# Altium project esp-programmer.PrjPcb
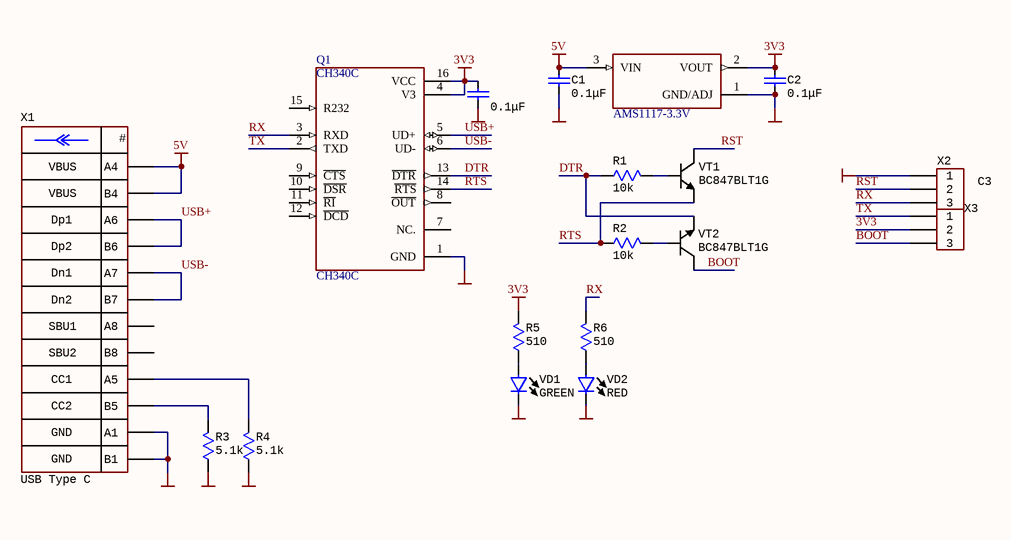
[diagram p0: esp-programmer.SchDoc]
1 sheet, 18 parts. Net scope: global (net labels, ports and power ports of the same name join across sheets).
Board file: esp-programmer.PcbDoc

## Sheet esp-programmer.SchDoc
size A; SheetNumber: 1; SheetTotal: 1

### Parts
C1  value 0.1μF  [CAP: 0603]  (hidden comment: CL10B104KA8NNNL)
C2  value 0.1μF  [CAP: 0603]  (hidden comment: CL10B104KA8NNNL)
C3  value 0.1μF  [CAP: 0603]  (hidden comment: CL10B104KA8NNNL)
Q1  CH340C  [CH240C]
R1  value 10k  [RES: 0603]  (hidden comment: RC0603FR-0710KL)
R2  value 10k  [RES: 0603]  (hidden comment: RC0603FR-0710KL)
R3  value 5.1k  [RES: 0603]  (hidden comment: RC0603FR-075K1L)
R4  value 5.1k  [RES: 0603]  (hidden comment: RC0603FR-075K1L)
R5  value 510  [RES: 0603]  (hidden comment: RC0603FR-07510RL)
R6  value 510  [RES: 0603]  (hidden comment: RC0603FR-07510RL)
VD1  Color: GREEN  [LED: 0603G]  (hidden comment: HSMG-C190)
VD2  Color: RED  [LED: 0603R]  (hidden comment: 155060SS75300)
VT1  BC847BLT1G  [SOT23]
VT2  BC847BLT1G  [SOT23]
X1  USB Type C  [CON: TYPE-C-31-M-12 (USB)]
X2  PMbus  [CON: PLS-3]  (value not drawn)
X3  PMbus  [CON: PLS-3]  (value not drawn)
  AMS1117-3.3V  [SOT223]

### Nets
3V3: C2.1 C3.1 Q1.4(V3) Q1.16(VCC) R5.2 X3.2 .2(VOUT)
5V: C1.1 X1.A4 X1.B4 .3(VIN)
GND: C1.2 C2.2 C3.2 Q1.1(GND) R3.1 R4.1 VD1.2 VD2.2 X1.A1 X1.B1 X2.1 .1(GND/ADJ)
BOOT: VT2.3(C) X3.3
DTR: Q1.13(~{DTR}) R1.1 VT2.2(E)
RST: VT1.3(C) X2.2
RTS: Q1.14(~{RTS}) R2.1 VT1.2(E)
RX: Q1.3(RXD) R6.2 X2.3
TX: Q1.2(TXD) X3.1
USB+: Q1.5(UD+) X1.A6 X1.B6
USB-: Q1.6(UD-) X1.A7 X1.B7
NetR1_2: R1.2 VT1.1(B)
NetR2_2: R2.2 VT2.1(B)
NetR3_2: R3.2 X1.B5
NetR4_2: R4.2 X1.A5
NetR5_1: R5.1 VD1.1
NetR6_1: R6.1 VD2.1

Not connected (* = marked no-connect by the designer): Q1 7(NC.) 8(~{OUT}) 9(~{CTS}) 10(~{DSR}) 11(~{RI}) 12(~{DCD}) 15(R232); X1 A8 B8

### Notes on the sheet
- (in symbol TYPE-C-31-M-12) #; VBUS; Dp1; Dp2; Dn1; Dn2; SBU1; SBU2; CC1; CC2; GND

### Library data of the parts
C1-C3 = CL10B104KA8NNNL: 0.1uF, 25V, 0603, X7R, ±10%, -55...+125°C; Manufacturer: Samsung; PartNumber: CL10B104KA8NNNL; HelpURL: https://ru.mouser.com/ProductDetail/Samsung-Electro-Mechanics/CL10B104KA8NNNL?qs=xZ%2FP%252Ba9zWqaq7Qa7Zbe03w%3D%3D; Package: 0603; Manufacturer Part Number: CL10B104KA8NNNL; Component Type: Capacitors
R1 R2 = RC0603FR-0710KL: 10 kOhms, 0603, ±1%, 0.1W, -55...+155°C; Manufacturer: Yageo; PartNumber: RC0603FR-0710KL; Package: 0603; HelpURL: https://ru.mouser.com/ProductDetail/YAGEO/RC0603FR-0710KL?qs=%2Fha2pyFaduhXXNW8qwNUNiw8kLtHezvba1btfWQYTvQl0E5hN277pA%3D%3D; Manufacturer Part Number: RC0603FR-0710KL; Component Type: Resistors
R3 R4 = RC0603FR-075K1L: 5.1 kOhms, 0603, ±1%, 0.1W, -55...+155°C; Manufacturer: Yageo; PartNumber: RC0603FR-075K1L; Package: 0603; HelpURL: https://eu.mouser.com/ProductDetail/YAGEO/RC0603FR-075K1L?qs=gt6vzsuosg2jUUwxnI2PJQ%3D%3D
R5 R6 = RC0603FR-07510RL: 510 Ohms, 0603, ±1%, 0.1W, -55...+155°C; Manufacturer: YAGEO; HelpURL: https://www.mouser.com/ProductDetail/YAGEO/RC0603FR-07510RL?qs=gt6vzsuosg04lV7mPQHzdw%3D%3D; PartNumber: RC0603FR-07510RL; Package: 0603; Manufacturer: Yageo; Manufacturer Part Number: RC0603FR-07510RL; Component Type: Resistors
VD1 = HSMG-C190: LED, Green, case 0603, 2.2V, 20mA, -40...+85°C; Manufacturer: Broadcom / Avago; Manufacturer: Broadcom Avago; Package: 0603; PartNumber: HSMG-C190; HelpURL: https://www.mouser.com/ProductDetail/Broadcom-Avago/HSMG-C190?qs=YDL0qNrpDT605sxOaps8VQ%3D%3D; Manufacturer Part Number: HSMG-C190; Component Type: Diodes
VD2 = 155060SS75300: LED, Red, case 0603, 2V, 20mA, -40...+85°C; Manufacturer: Wurth; Manufacturer: Wurth Electronics; HelpURL: https://ru.mouser.com/ProductDetail/Wurth-Elektronik/155060SS75300?qs=GedFDFLaBXFp%252Bdn3xLi%2Ftw%3D%3D; Package: 0603; PartNumber: 155060SS75300; Manufacturer Part Number: 155060SS75300; Component Type: Diodes
VT1 VT2 = BC847BLT1G: NPN, 45V, 100mA, 100MHz, SOT-23, -55...+150°C; Manufacturer: ON Semiconductor; Package: SOT-23; HelpURL: https://eu.mouser.com/ProductDetail/onsemi/BC847BLT1G?qs=vNc2DXHODiLAH81QlkcRzw%3D%3D; Manufacturer Part Number: BC847BLT1G; Component Type: Transistors; PartNumber: BC847BLT1G
X1 = TYPE-C-31-M-12: USB 3.1, Type C, 16 pins, 20V, 3.0A, -40...+85°C; Manufacturer: Korean Hroparts; HelpURL: https://lcsc.com/product-detail/USB-Type-C_Korean-Hroparts-Elec-TYPE-C-31-M-12_C165948.html; Package: Type C, 16 pins; PartNumber: TYPE-C-31-M-12
X2 X3 = PLS-3: 3 pins, pitch 2.54 mm, 500VAC, 2A/pin, -40...+85°C; Manufacturer: Connfly; Pitch: 2.54mm; PartNumber: PLS-3; HelpURL: https://www.chipdip.ru/product/pls-3; Manufacturer Part Number: PLS-3; Component Type: Connectors